# Altium schematic sheet Keypad.SchDoc
size A
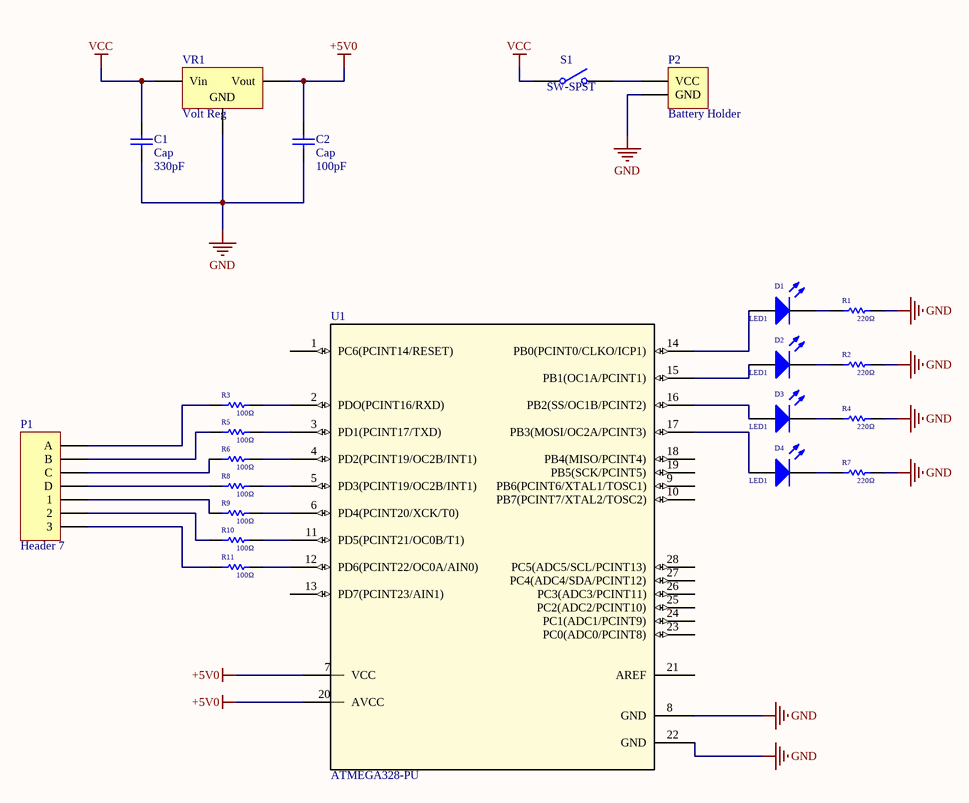
[diagram p0: Keypad.SchDoc]

## Parts
C1  Cap  value 330pF  [RAD-0.3]
C2  Cap  value 100pF  [RAD-0.3]
D1  LED1  [LED-1]
D2  LED1  [LED-1]
D3  LED1  [LED-1]
D4  LED1  [LED-1]
P1  Header 7  [HDR1X7]
P2  Battery Holder  [HDR1X2]
R1  220Ω  [AXIAL-0.3]
R2  220Ω  [AXIAL-0.3]
R3  100Ω  [AXIAL-0.3]
R4  220Ω  [AXIAL-0.3]
R5  100Ω  [AXIAL-0.3]
R6  100Ω  [AXIAL-0.3]
R7  220Ω  [AXIAL-0.3]
R8  100Ω  [AXIAL-0.3]
R9  100Ω  [AXIAL-0.3]
R10  100Ω  [AXIAL-0.3]
R11  100Ω  [AXIAL-0.3]
S1  SW-SPST  [SPST-2]
U1  ATMEGA328-PU  [28P3_SPDIP28_SP_MCH]
VR1  Volt Reg  [D2PAK_N]

## Nets
+5V0: C2.1 U1.7(VCC) U1.20(AVCC) VR1.3(Vout)
GND: C1.2 C2.2 P2.2(GND) R1.2 R2.2 R4.2 R7.2 U1.8(GND) U1.22(GND) VR1.2(GND)
VCC: C1.1 S1.1(COMMON) VR1.1(Vin)
NetD1_1: D1.1(A) U1.14(PB0(PCINT0/CLKO/ICP1))
NetD1_2: D1.2(K) R1.1
NetD2_1: D2.1(A) U1.15(PB1(OC1A/PCINT1))
NetD2_2: D2.2(K) R2.1
NetD3_1: D3.1(A) U1.16(PB2(SS/OC1B/PCINT2))
NetD3_2: D3.2(K) R4.1
NetD4_1: D4.1(A) U1.17(PB3(MOSI/OC2A/PCINT3))
NetD4_2: D4.2(K) R7.1
NetP1_1: P1.1(3) R11.1
NetP1_2: P1.2 R10.1
NetP1_3: P1.3(1) R9.1
NetP1_4: P1.4(D) R8.1
NetP1_5: P1.5(C) R6.1
NetP1_6: P1.6(B) R5.1
NetP1_7: P1.7(A) R3.1
NetP2_1: P2.1(VCC) S1.2(NO)
NetR3_2: R3.2 U1.2(PDO(PCINT16/RXD))
NetR5_2: R5.2 U1.3(PD1(PCINT17/TXD))
NetR6_2: R6.2 U1.4(PD2(PCINT19/OC2B/INT1))
NetR8_2: R8.2 U1.5(PD3(PCINT19/OC2B/INT1))
NetR9_2: R9.2 U1.6(PD4(PCINT20/XCK/T0))
NetR10_2: R10.2 U1.11(PD5(PCINT21/OC0B/T1))
NetR11_2: R11.2 U1.12(PD6(PCINT22/OC0A/AIN0))

Not connected (* = marked no-connect by the designer): U1 1(PC6(PCINT14/RESET)) 9(PB6(PCINT6/XTAL1/TOSC1)) 10(PB7(PCINT7/XTAL2/TOSC2)) 13(PD7(PCINT23/AIN1)) 18(PB4(MISO/PCINT4)) 19(PB5(SCK/PCINT5)) 21(AREF) 23(PC0(ADC0/PCINT8)) 24(PC1(ADC1/PCINT9)) 25(PC2(ADC2/PCINT10)) 26(PC3(ADC3/PCINT11)) 27(PC4(ADC4/SDA/PCINT12)) 28(PC5(ADC5/SCL/PCINT13))

## Library data of the parts
C1 C2 = Cap: Capacitor; Published: 8-Jun-2000; LatestRevisionDate: 17-Jul-2002; LatestRevisionNote: Re-released for DXP Platform.; PackageReference: RAD-0.3; Publisher: Altium Limited; PackageDescription: Radial Cap, Thru-Hole; 2 Leads; 0.3 in Pin Spacing
D1-D4 = LED1: Typical RED GaAs LED; Published: 8-Jun-2000; LatestRevisionDate: 08-Jul-2005; LatestRevisionNote: Mech Layer 1 removed.; PackageReference: LED-1; Publisher: Altium Limited; PackageDescription: LED; 2 Leads
P1 = Header 7: Header, 7-Pin; LatestRevisionDate: 17-Jul-2002; LatestRevisionNote: Re-released for DXP Platform.; Publisher: Altium Limited
P2 = Header 2: Header, 2-Pin; LatestRevisionDate: 17-Jul-2002; LatestRevisionNote: Re-released for DXP Platform.; Publisher: Altium Limited
R1 R2 R4 R7 = Res1: Resistor; Value: 220; Published: 8-Jun-2000; LatestRevisionDate: 17-Jul-2002; LatestRevisionNote: Re-released for DXP Platform.; PackageReference: AXIAL-0.3; Publisher: Altium Limited; PackageDescription: Axial Device, Thru-Hole; 2 Leads; 0.3 in Pin Spacing
R3 R5 R6 R8-R11 = Res1: Resistor; Value: 100; Published: 8-Jun-2000; LatestRevisionDate: 17-Jul-2002; LatestRevisionNote: Re-released for DXP Platform.; PackageReference: AXIAL-0.3; Publisher: Altium Limited; PackageDescription: Axial Device, Thru-Hole; 2 Leads; 0.3 in Pin Spacing
S1 = SW-SPST: Single-Pole, Single-Throw Switch; Published: 24-Mar-1999; LatestRevisionDate: 17-Jul-2002; LatestRevisionNote: Re-released for DXP Platform.; PackageReference: SPST-2; Publisher: Altium Limited; PackageDescription: Switch; 2 Leads
U1 = ATMEGA328-PU: No Description Available; SourceLibrary: Update_to_database_2021-05-13; Built_By: EMA_Cory; Vendor: Microchip; Datasheet: https://ww1.microchip.com/downloads/en/DeviceDoc/ATmega48A-PA-88A-PA-168A-PA-328-P-DS-DS40002061B.pdf; Copyright: Copyright (C) 2018 Accelerated Designs. All rights reserved; Manufacturer_Part_Number: ATMEGA328-PU; RefDes: RefDes; Type: DEV
VR1 = Volt Reg: Voltage Regulator; Published: 24-Mar-1999; LatestRevisionDate: 29-May-2009; LatestRevisionNote: IPC-7351 Footprint Added.; PackageReference: D2PAK; Publisher: Altium Limited; PackageDescription: 3-Pin Transistor Outline Package 2.54 mm Pitch, 15.1 mm Lead Span